# Altium schematic sheet Remote.SchDoc
size A
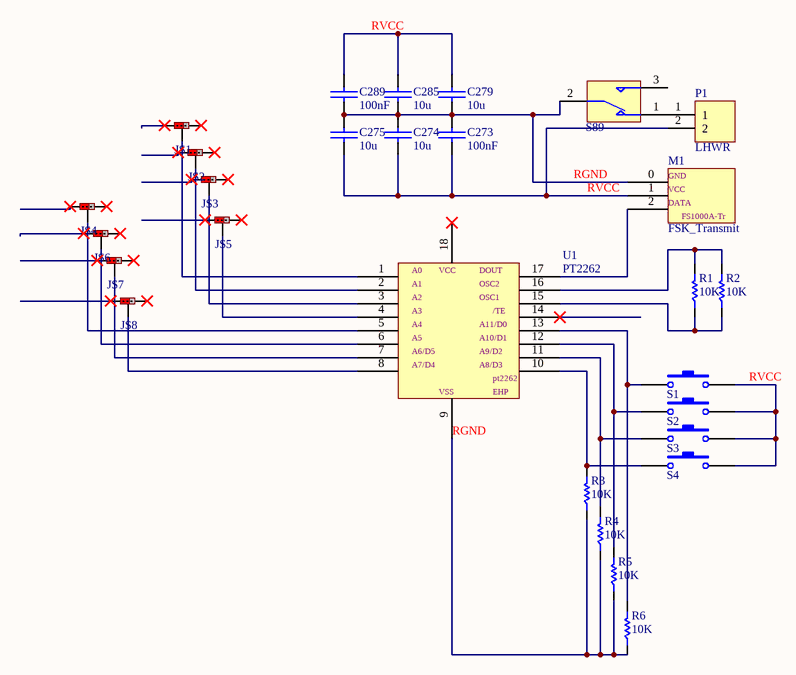
[diagram p0: Remote.SchDoc]

## Parts
C273  100nF  [SMD_CAP_1206]
C274  10u  [SMD_CAP_1206]
C275  10u  [SMD_CAP_1206]
C279  10u  [SMD_CAP_1206]
C285  10u  [SMD_CAP_1206]
C289  100nF  [SMD_CAP_1206]
JS1  JumperSMD 3Pin  [JumperSMD 3Pin]  (value not drawn)
JS2  JumperSMD 3Pin  [JumperSMD 3Pin]  (value not drawn)
JS3  JumperSMD 3Pin  [JumperSMD 3Pin]  (value not drawn)
JS4  JumperSMD 3Pin  [JumperSMD 3Pin]  (value not drawn)
JS5  JumperSMD 3Pin  [JumperSMD 3Pin]  (value not drawn)
JS6  JumperSMD 3Pin  [JumperSMD 3Pin]  (value not drawn)
JS7  JumperSMD 3Pin  [JumperSMD 3Pin]  (value not drawn)
JS8  JumperSMD 3Pin  [JumperSMD 3Pin]  (value not drawn)
M1  FSK_Transmit  [FSK_TRA]
P1  LHWR  [Polarized Header 2]
R1  10K  [RES 1206 (3216X08L)]
R2  10K  [RES 1206 (3216X08L)]
R3  10K  [RES 1206 (3216X08L)]
R4  10K  [RES 1206 (3216X08L)]
R5  10K  [RES 1206 (3216X08L)]
R6  10K  [RES 1206 (3216X08L)]
S1  Switch PB  [Switch - Push to On]  (value not drawn)
S2  Switch PB  [Switch - Push to On]  (value not drawn)
S3  Switch PB  [Switch - Push to On]  (value not drawn)
S4  Switch PB  [Switch - Push to On]  (value not drawn)
S89  Switch SPDT_Subminiator  [SPDT Subminiator]  (value not drawn)
U1  PT2262  [PT2262]

## Nets
RGND: C273.1(+) C274.1(+) C275.1(+) C279.1(+) C285.1(+) C289.1(+) M1.0 R3.1 R4.1 R5.1 R6.1 S89.2 U1.9
RVCC: C273.2(-) C274.2(-) C275.2(-) C279.2(-) C285.2(-) C289.2(-) M1.1 P1.2 S1.2 S2.2 S3.2 S4.2
NetJS1_2: JS1.2 U1.1
NetJS2_2: JS2.2 U1.2
NetJS3_2: JS3.2 U1.3
NetJS4_2: JS4.2 U1.5
NetJS5_2: JS5.2 U1.4
NetJS6_2: JS6.2 U1.6
NetJS7_2: JS7.2 U1.7
NetJS8_2: JS8.2 U1.8
NetM1_2: M1.2 U1.17
NetP1_1: P1.1 S89.1
NetR1_1: R1.1 R2.1 U1.15
NetR1_2: R1.2 R2.2 U1.16
NetR3_2: R3.2 S4.1 U1.10
NetR4_2: R4.2 S3.1 U1.11
NetR5_2: R5.2 S2.1 U1.12
NetR6_2: R6.2 S1.1 U1.13

Not connected (* = marked no-connect by the designer): JS1 1* 3*; JS2 1* 3*; JS3 1* 3*; JS4 1* 3*; JS5 1* 3*; JS6 1* 3*; JS7 1* 3*; JS8 1* 3*; S89 3; U1 14* 18*

## Notes on the sheet
- (in symbol FSK_Transmit) GND; VCC; DATA; FS1000A-Tr
- (in symbol PT2262) A0; VCC; DOUT; A1; OSC2; A2; OSC1; A3; /TE; A4; A11/D0; A5; A10/D1; A6/D5; A9/D2; A7/D4; A8/D3; pt2262; VSS; EHP

## Library data of the parts
C273-C275 C279 C285 C289 = Cap-Bipolar: Bipolar Capacitor; Voltage: 100V; Designer: Saeid Jorablo; Organazation: ControTec; Adding Date: 1387/12/20
  C273 C289: Value: 100nF
  C274 C275 C279 C285: Value: 10u
P1 = 2pin LHWR: Designer:: Hamed Jafarzadeh - www.R2T.ir
R1-R6 = Resistor: Tolerance: 5%; Power: 1/8 W; Value: 10K
S1-S4 = Switch PB: Push Button Switch
S89 = Switch SPDT_Subminiator: Subminiator SPDT Switch; Company: E.P.I.L; Design date: 2011/11/02